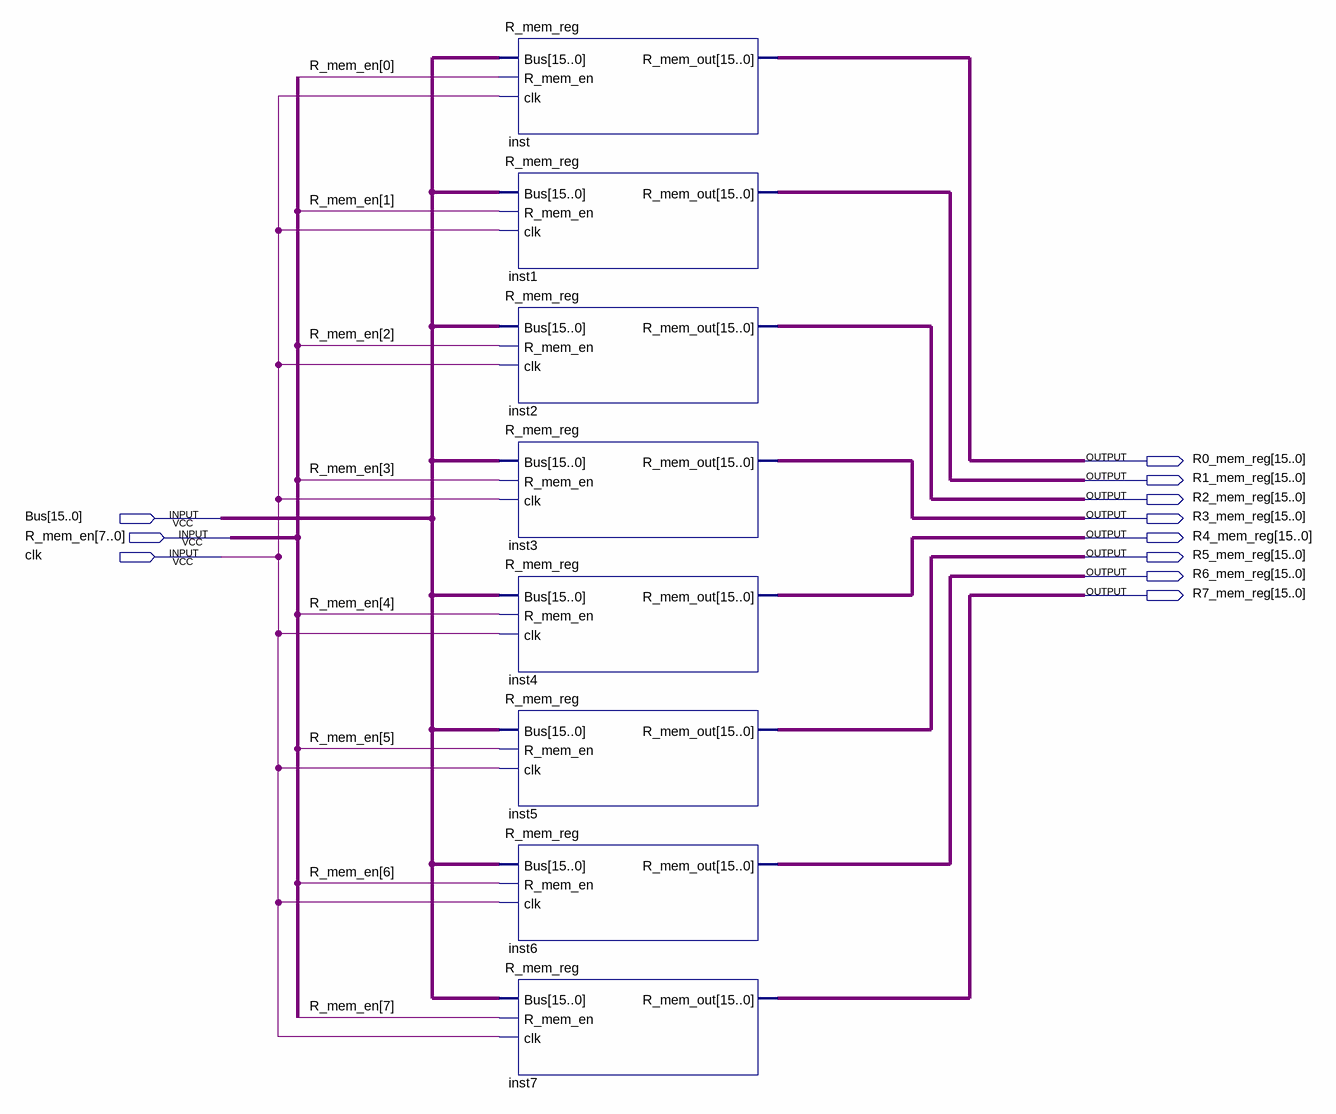
[diagram p0: schematic sheet]
// Quartus schematic R_mem_bank.bdf as structural Verilog: 8 symbols, 11 pins
module R_mem_bank (
  input  [15:0] Bus,
  input  [7:0] R_mem_en,
  input  clk,
  output [15:0] R0_mem_reg,
  output [15:0] R1_mem_reg,
  output [15:0] R2_mem_reg,
  output [15:0] R3_mem_reg,
  output [15:0] R4_mem_reg,
  output [15:0] R5_mem_reg,
  output [15:0] R6_mem_reg,
  output [15:0] R7_mem_reg
);

  R_mem_reg inst (.Bus(Bus), .R_mem_en(R_mem_en[0]), .clk(clk), .R_mem_out(R0_mem_reg));
  R_mem_reg inst1 (.Bus(Bus), .R_mem_en(R_mem_en[1]), .clk(clk), .R_mem_out(R1_mem_reg));
  R_mem_reg inst2 (.Bus(Bus), .R_mem_en(R_mem_en[2]), .clk(clk), .R_mem_out(R2_mem_reg));
  R_mem_reg inst3 (.Bus(Bus), .R_mem_en(R_mem_en[3]), .clk(clk), .R_mem_out(R3_mem_reg));
  R_mem_reg inst4 (.Bus(Bus), .R_mem_en(R_mem_en[4]), .clk(clk), .R_mem_out(R4_mem_reg));
  R_mem_reg inst5 (.Bus(Bus), .R_mem_en(R_mem_en[5]), .clk(clk), .R_mem_out(R5_mem_reg));
  R_mem_reg inst6 (.Bus(Bus), .R_mem_en(R_mem_en[6]), .clk(clk), .R_mem_out(R6_mem_reg));
  R_mem_reg inst7 (.Bus(Bus), .R_mem_en(R_mem_en[7]), .clk(clk), .R_mem_out(R7_mem_reg));
endmodule
